# EAGLE board 16_Bit_Register (EAGLE 9.6.2)
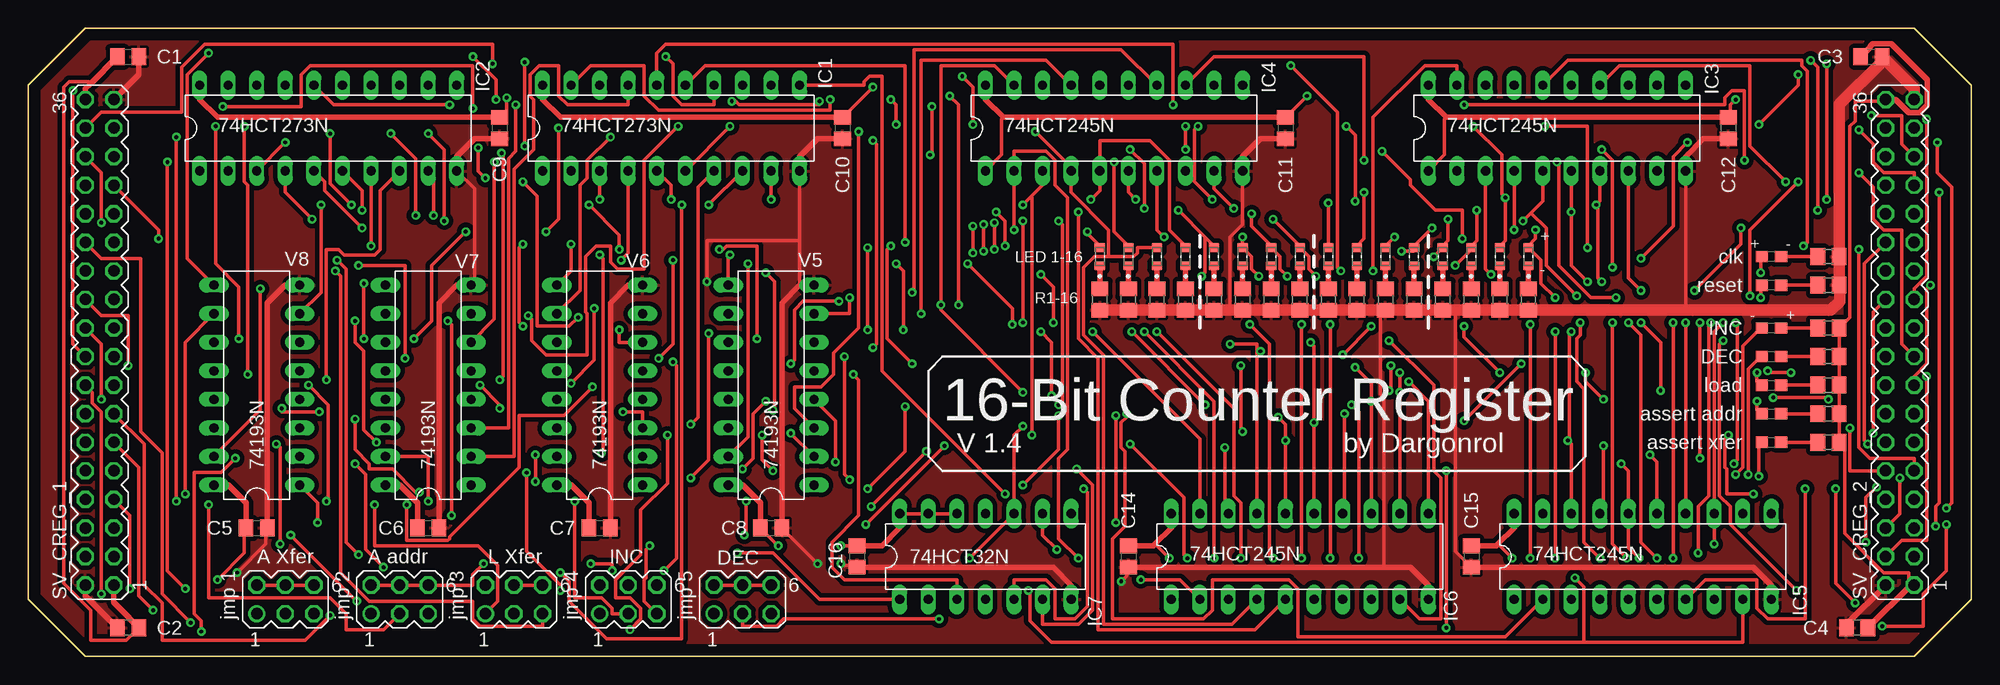
[diagram p1: board, top side]
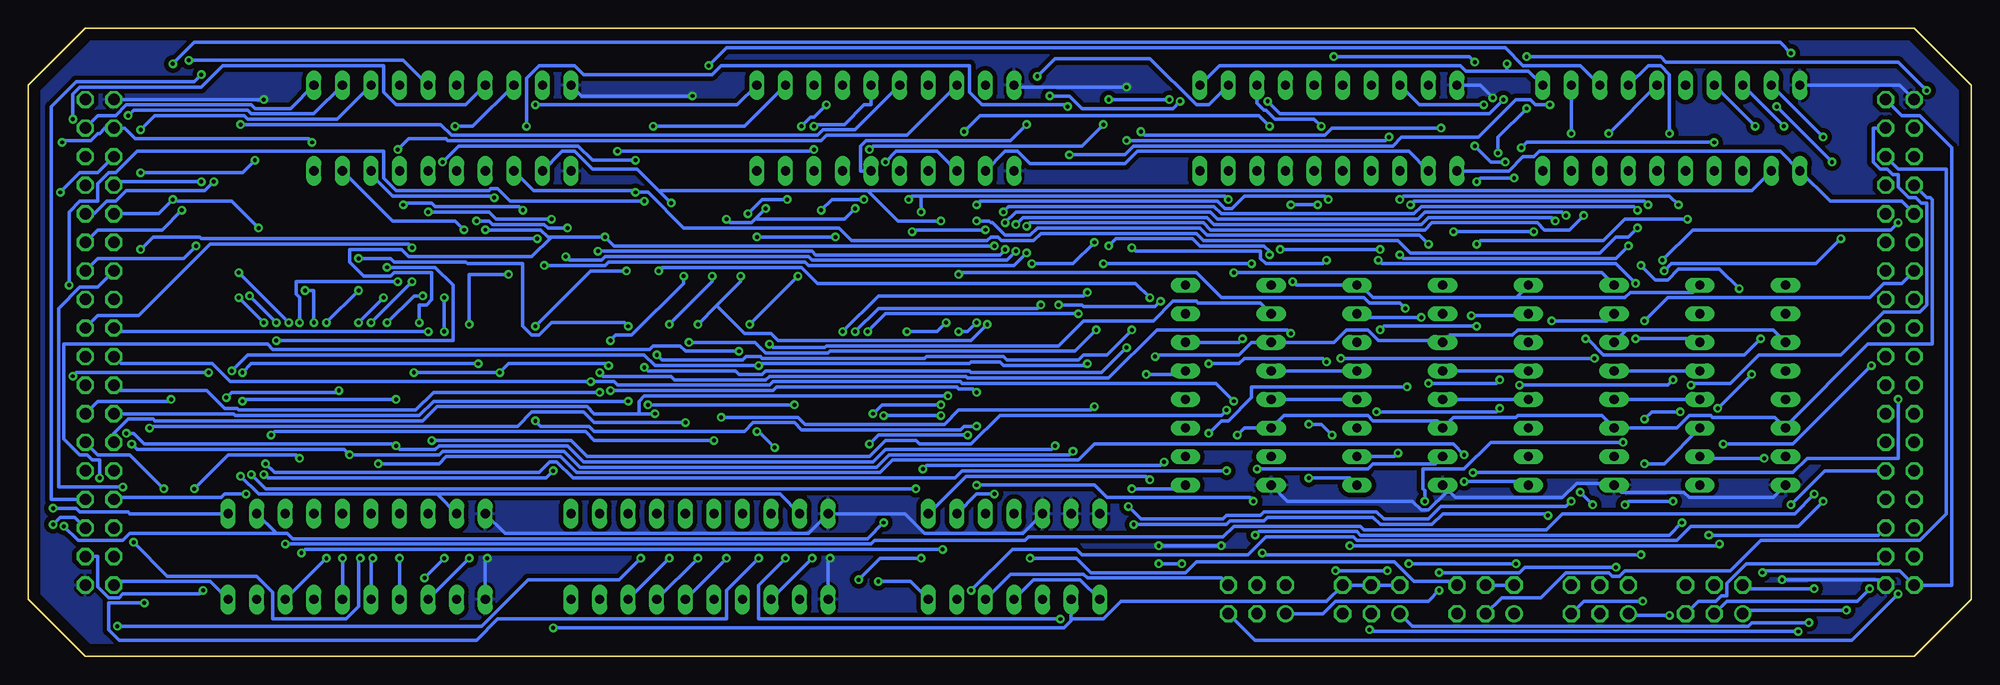
[diagram p2: board, bottom side, seen from below]

Size 172.72 x 55.88 mm. Coordinates in mm from the lower left corner, seen from the top.
Outline: 0,50.8 0,5.08 5.08,0 167.64,0 172.72,5.08 172.72,50.8 167.64,55.88 5.08,55.88 0,50.8
Copper layers (1*16): Top 0.035mm / dielectric 1.5mm / Bottom 0.035mm
Design rules "default *": minimum track width 12mil, minimum drill 0.35mm, track to track 6mil, track to pad 6mil, pad to pad 6mil, via to via 6mil, smd to smd 6mil, copper to edge 40mil, drill to drill 6mil, minimum pad ring 10mil, minimum via ring 8mil, stop-mask expansion 4mil, vias tented up to drill 0mil, thermal gap 10mil

## Footprints (pad centres in the part's own frame; a part is rotated, then mirrored left to right if it is on the bottom)
0603 = smd 1.1 x 1: 1 -0.85,0; 2 0.85,0
C0805 = smd 1.3 x 1.5: 1 -0.95,0; 2 0.95,0
DIL20 = drill 0.813 long: 1 -11.43,-3.81; 2 -8.89,-3.81; 3 -6.35,-3.81; 4 -3.81,-3.81; 5 -1.27,-3.81; 6 1.27,-3.81; 7 3.81,-3.81; 8 6.35,-3.81; 9 8.89,-3.81; 10 11.43,-3.81; 11 11.43,3.81; 12 8.89,3.81; 13 6.35,3.81; 14 3.81,3.81; 15 1.27,3.81; 16 -1.27,3.81; 17 -3.81,3.81; 18 -6.35,3.81; 19 -8.89,3.81; 20 -11.43,3.81
DIL14 = drill 0.813 long: 1 -7.62,-3.81; 2 -5.08,-3.81; 3 -2.54,-3.81; 4 0,-3.81; 5 2.54,-3.81; 6 5.08,-3.81; 7 7.62,-3.81; 8 7.62,3.81; 9 5.08,3.81; 10 2.54,3.81; 11 0,3.81; 12 -2.54,3.81; 13 -5.08,3.81; 14 -7.62,3.81
LEDC1608X45N = smd 0.81 x 0.93: A 0.81,0; C -0.81,0
R0805 = smd 1.3 x 1.5: 1 -0.95,0; 2 0.95,0
MA03-2 = drill 1.016: 1 -2.54,-1.27 | drill 1.016 octagon: 2 -2.54,1.27; 3 0,-1.27; 4 0,1.27; 5 2.54,-1.27; 6 2.54,1.27
MA18-2 = drill 1.016 octagon: 1 -21.59,-1.27; 2 -21.59,1.27; 3 -19.05,-1.27; 4 -19.05,1.27; 5 -16.51,-1.27; 6 -16.51,1.27; 7 -13.97,-1.27; 8 -13.97,1.27; 9 -11.43,-1.27; 10 -11.43,1.27; 11 -8.89,-1.27; 12 -8.89,1.27; 13 -6.35,-1.27; 14 -6.35,1.27; 15 -3.81,-1.27; 16 -3.81,1.27; 17 -1.27,-1.27; 18 -1.27,1.27; 19 1.27,-1.27; 20 1.27,1.27; 21 3.81,-1.27; 22 3.81,1.27; 23 6.35,-1.27; 24 6.35,1.27; 25 8.89,-1.27; 26 8.89,1.27; 27 11.43,-1.27; 28 11.43,1.27; 29 13.97,-1.27; 30 13.97,1.27; 31 16.51,-1.27; 32 16.51,1.27; 33 19.05,-1.27; 34 19.05,1.27; 35 21.59,-1.27; 36 21.59,1.27
DIL16 = drill 0.813 long: 1 -8.89,-3.81; 2 -6.35,-3.81; 3 -3.81,-3.81; 4 -1.27,-3.81; 5 1.27,-3.81; 6 3.81,-3.81; 7 6.35,-3.81; 8 8.89,-3.81; 9 8.89,3.81; 10 6.35,3.81; 11 3.81,3.81; 12 1.27,3.81; 13 -1.27,3.81; 14 -3.81,3.81; 15 -6.35,3.81; 16 -8.89,3.81

## Placement (x,y rotation side)
ASSERT_ADDR  LTST-C193TBKT-5A  [0603]  154.94,21.59 0 top
ASSERT_XFER  LTST-C193TBKT-5A  [0603]  154.94,19.05 0 top
C1  1µF  [C0805]  8.89,53.34 0 top
C2  1µF  [C0805]  8.89,2.54 180 top
C3  1µF  [C0805]  163.83,53.34 0 top
C4  1µF  [C0805]  162.56,2.54 180 top
C5  100pF  [C0805]  20.32,11.43 0 top
C6  100pF  [C0805]  35.56,11.43 0 top
C7  100pF  [C0805]  50.8,11.43 0 top
C8  100pF  [C0805]  66.04,11.43 0 top
C9  100pF  [C0805]  41.91,46.99 270 top
C10  100pF  [C0805]  72.39,46.99 270 top
C11  100pF  [C0805]  111.76,46.99 270 top
C12  100pF  [C0805]  151.13,46.99 270 top
C14  100pF  [C0805]  97.79,8.89 270 top
C15  100pF  [C0805]  128.27,8.89 270 top
C16  100pF  [C0805]  73.66,8.89 270 top
CLK  LTST-C193TBKT-5A  [0603]  154.94,35.56 180 top
DEC  LTST-C193TBKT-5A  [0603]  154.94,26.67 0 top
IC1  74HCT273N  [DIL20]  57.15,46.99 0 top
IC2  74HCT273N  [DIL20]  26.67,46.99 0 top
IC3  74HCT245N  [DIL20]  135.89,46.99 0 top
IC4  74HCT245N  [DIL20]  96.52,46.99 0 top
IC5  74HCT245N  [DIL20]  143.51,8.89 0 top
IC6  74HCT245N  [DIL20]  113.03,8.89 0 top
IC7  74HCT32N  [DIL14]  85.09,8.89 0 top
INC  LTST-C193TBKT-5A  [0603]  154.94,29.21 0 top
LED_1  LTST-C193KRKT-5A  [LEDC1608X45N]  133.35,35.56 90 top
LED_2  LTST-C193KRKT-5A  [LEDC1608X45N]  130.81,35.56 90 top
LED_3  LTST-C193KRKT-5A  [LEDC1608X45N]  128.27,35.56 90 top
LED_4  LTST-C193KRKT-5A  [LEDC1608X45N]  125.73,35.56 90 top
LED_5  LTST-C193KRKT-5A  [LEDC1608X45N]  123.19,35.56 90 top
LED_6  LTST-C193KRKT-5A  [LEDC1608X45N]  120.65,35.56 90 top
LED_7  LTST-C193KRKT-5A  [LEDC1608X45N]  118.11,35.56 90 top
LED_8  LTST-C193KRKT-5A  [LEDC1608X45N]  115.57,35.56 90 top
LED_9  LTST-C193KRKT-5A  [LEDC1608X45N]  113.03,35.56 90 top
LED_10  LTST-C193KRKT-5A  [LEDC1608X45N]  110.49,35.56 90 top
LED_11  LTST-C193KRKT-5A  [LEDC1608X45N]  107.95,35.56 90 top
LED_12  LTST-C193KRKT-5A  [LEDC1608X45N]  105.41,35.56 90 top
LED_13  LTST-C193KRKT-5A  [LEDC1608X45N]  102.87,35.56 90 top
LED_14  LTST-C193KRKT-5A  [LEDC1608X45N]  100.33,35.56 90 top
LED_15  LTST-C193KRKT-5A  [LEDC1608X45N]  97.79,35.56 90 top
LED_16  LTST-C193KRKT-5A  [LEDC1608X45N]  95.25,35.56 90 top
LOAD  LTST-C193TBKT-5A  [0603]  154.94,24.13 0 top
R1  1600  [R0805]  133.35,31.75 90 top
R2  1600  [R0805]  130.81,31.75 90 top
R3  1600  [R0805]  128.27,31.75 90 top
R4  1600  [R0805]  125.73,31.75 90 top
R5  1600  [R0805]  123.19,31.75 90 top
R6  1600  [R0805]  120.65,31.75 90 top
R7  1600  [R0805]  118.11,31.75 90 top
R8  1600  [R0805]  115.57,31.75 90 top
R9  1600  [R0805]  113.03,31.75 90 top
R10  1600  [R0805]  110.49,31.75 90 top
R11  1600  [R0805]  107.95,31.75 90 top
R12  1600  [R0805]  105.41,31.75 90 top
R13  1600  [R0805]  102.87,31.75 90 top
R14  1600  [R0805]  100.33,31.75 90 top
R15  1600  [R0805]  97.79,31.75 90 top
R16  1600  [R0805]  95.25,31.75 90 top
R17  560  [R0805]  160.02,35.56 180 top
R18  560  [R0805]  160.02,33.02 180 top
R19  560  [R0805]  160.02,19.05 0 top
R20  560  [R0805]  160.02,21.59 0 top
R21  560  [R0805]  160.02,24.13 0 top
R22  560  [R0805]  160.02,29.21 0 top
R23  560  [R0805]  160.02,26.67 0 top
RESET  LTST-C193TBKT-5A  [0603]  154.94,33.02 180 top
SV3  [MA03-2]  22.86,5.08 0 top
SV4  [MA03-2]  33.02,5.08 0 top
SV5  [MA03-2]  43.18,5.08 0 top
SV6  [MA03-2]  53.34,5.08 0 top
SV7  [MA03-2]  63.5,5.08 0 top
SV_CREG_1  [MA18-2]  6.35,27.94 90 top
SV_CREG_2  [MA18-2]  166.37,27.94 90 top
V5  74193N  [DIL16]  66.04,24.13 90 top
V6  74193N  [DIL16]  50.8,24.13 90 top
V7  74193N  [DIL16]  35.56,24.13 90 top
V8  74193N  [DIL16]  20.32,24.13 90 top

## Tracks (layer width: path | path; a pad name or v marks a point on that pad's centre or on a via)
!BUS_CTRL_CREG_ASSERT_ADDR  (via drill 0.35)
  Top 0.305: v26.83,3.65 24.61,1.43 11.91,1.43 11.91,4.76 10.32,6.35 10.32,18.89 SV_CREG_1.13
  Bottom 0.305: SV4.1 30.32,3.65 v26.83,3.65
!BUS_CTRL_CREG_ASSERT_XFER  (via drill 0.35)
  Top 0.305: v11.11,4.13 9.84,5.4 9.84,16.83 SV_CREG_1.11
  Bottom 0.305: SV3.1 20,4.13 v11.11,4.13
!BUS_CTRL_CREG_DEC  (via drill 0.35)
  Top 0.305: SV_CREG_1.20 6.51,27.78 v6.51,22.86 | v44.29,16.35 44.29,9.37 47.31,6.35 v47.31,5.87
  Bottom 0.305: v6.51,22.86 6.51,17.62 14.61,17.62 15.88,16.35 v44.29,16.35 | v47.31,5.87 48.26,4.92 56.52,4.92 57.63,3.81 SV7.1
!BUS_CTRL_CREG_INC  (via drill 0.35)
  Top 0.305: SV_CREG_1.26 6.51,35.4 10,35.4 10,20 11.91,18.1 11.91,5.56 v14.45,3.02
  Bottom 0.305: v14.45,3.02 19.53,3.02 19.84,2.7 49.69,2.7 SV6.1
!BUS_CTRL_CREG_LOAD_XFER  (via drill 0.35)
  Top 0.305: SV5.1 41.75,4.92 41.75,8.1 40.01,9.84 30.8,9.84 v30.8,13.49 | v26.51,13.81 26.67,13.97 26.67,22.38 v24.92,24.13
  Bottom 0.305: v30.8,13.49 30.48,13.81 v26.51,13.81 | v24.92,24.13 24.77,24.29 21.43,24.29 18.89,26.83 11.59,26.83 7.78,30.64 4.6,30.64 3.97,31.27 3.97,40.32 4.45,40.32 4.92,40.8 5.56,40.8 6.51,41.75 6.51,42.86 6.99,42.86 7.46,43.34 8.1,43.34 8.73,43.97 8.73,46.99 SV_CREG_1.33
!BUS_CTRL_PC_ASSERT_ADDR  (via drill 0.35)
  Top 0.305: v29.21,4.92 v23.34,10.79
  Bottom 0.305: SV_CREG_1.5 8.26,10.79 v23.34,10.79 | v29.21,4.92 34.45,4.92 SV4.5
!BUS_CTRL_PC_ASSERT_XFER
  Bottom 0.305: SV_CREG_1.3 8.26,8.26 20,8.26 21.75,6.51 21.75,5.4 22.23,5.4 22.7,4.92 24.29,4.92 SV3.5
!BUS_CTRL_PC_DEC  (via drill 0.35)
  Top 0.305: SV_CREG_1.16 5.71,23.5 5.71,22.54 6.51,21.75 v6.51,5.56
  Bottom 0.305: v6.51,5.56 10.64,1.43 63.66,1.43 SV7.5
!BUS_CTRL_PC_INC  (via drill 0.35)
  Top 0.305: SV_CREG_1.22 6.51,30.32 8.89,30.32 v8.89,25.88 | v22.07,18.89 22.38,18.57 v22.38,10 | v55.24,9.84 54.93,9.53 54.93,6.99 54.77,6.83 54.77,4.92 SV6.5
  Bottom 0.305: v8.89,25.88 15.88,18.89 v22.07,18.89 | v22.38,10 22.54,9.84 v55.24,9.84
!BUS_CTRL_PC_LOAD_XFER  (via drill 0.35)
  Top 0.305: SV_CREG_1.29 11.59,37.94 v11.59,37.15 | v27.3,34.29 27.78,33.81 27.78,7.46 30.32,4.92 39.53,4.92 39.53,3.33 40.16,2.7 45.72,2.7 SV5.5
  Bottom 0.305: v11.59,37.15 13.81,34.92 26.67,34.92 v27.3,34.29
!BUS_CTRL_SP_ASSERT_ADDR  (via drill 0.35)
  Top 0.305: SV4.3 31.59,2.38 28.26,2.38 28.26,3.81 26.83,5.24 16.03,5.24 v16.03,13.49
  Bottom 0.305: v16.03,13.49 13.02,16.51 SV_CREG_1.9
!BUS_CTRL_SP_ASSERT_XFER  (via drill 0.35)
  Top 0.305: SV_CREG_1.7 9.05,12.54 v9.05,6.03
  Bottom 0.305: v9.05,6.03 10.16,4.92 21.75,4.92 SV3.3
!BUS_CTRL_SP_DEC  (via drill 0.35)
  Top 0.305: SV_CREG_1.18 3.97,27.78 v3.97,50.32 | v39.53,53.34 41.59,51.28 v41.59,49.53 | v62.55,49.37 62.87,49.37 63.18,49.05 70.33,49.05 v70.33,49.37 | v81.92,49.85 82.71,49.05 v82.71,31.27 | v99.22,28.89 105.41,22.7 v105.41,8.73 | v80.96,3.33 67.15,3.33 66.52,2.7 63.5,2.7 SV7.3
  Bottom 0.305: v3.97,50.32 6.51,52.86 27.15,52.86 27.62,53.34 v39.53,53.34 | v41.59,49.53 42.86,48.26 61.44,48.26 v62.55,49.37 | v70.33,49.37 70.96,48.74 79.06,48.74 80.17,49.85 v81.92,49.85 | v82.71,31.27 83.03,30.96 97.16,30.96 v99.22,28.89 | v105.41,8.73 107.79,6.35 107.79,3.33 v80.96,3.33
!BUS_CTRL_SP_INC  (via drill 0.35)
  Top 0.305: SV6.3 51.91,3.81 51.91,4.29 50.96,5.24 48.58,5.24 v48.58,13.81 | v30.96,19.05 29.84,20.16 29.84,27.15 29.05,27.94 v29.05,29.84
  Bottom 0.305: v48.58,13.81 48.58,14.76 48.74,14.92 48.74,16.67 45.09,16.67 42.7,19.05 v30.96,19.05 | v29.05,29.84 26.99,31.91 9.05,31.91 7.78,33.18 6.19,33.18 SV_CREG_1.24
!BUS_CTRL_SP_LOAD_XFER
  Bottom 0.305: SV5.3 41.75,5.24 38.26,5.24 36.04,7.46 32.23,7.46 31.91,7.14 31.27,7.14 30.8,7.62 21.43,7.62 18.73,10.32 4.6,10.32 2.22,12.7 2.22,43.34 6.51,43.34 SV_CREG_1.31
!CTRL_CREG_ASSERT_ADDR  (via drill 0.35)
  Top 0.305: SV4.2 SV4.4 SV4.6 39.53,6.35 39.53,7.3 v40.48,8.26 | v153.67,22.7 153.67,21.91 153.99,21.59 ASSERT_ADDR.1 | v140.02,22.86 138.43,24.45 v138.43,25.24 | v130.81,25.24 127.64,28.42 v127.64,29.37 | v119.54,34.29 119.54,47.94 124.14,52.55 127,52.55 IC3.19 | IC4.19 85.88,52.55 81.12,52.55 v81.12,31.27 81.12,30.8 v88.42,23.5 | v120.97,23.65 121.13,23.81 v121.13,25.88 | v50.01,8.26 51.91,8.26 v51.91,7.62 | v56.52,7.62 57.63,8.73 57.63,25.88 v57.31,26.19 | v67.79,26.04 68.1,26.35 68.1,30.8 68.9,31.59 v72.07,31.59
  Bottom 0.305: v153.67,22.7 153.51,22.86 v140.02,22.86 | v138.43,25.24 v130.81,25.24 130.02,26.04 121.28,26.04 v121.13,25.88 | v127.64,29.37 122.71,34.29 v119.54,34.29 | v88.42,23.5 88.74,23.81 90.01,23.81 90.17,23.97 106.2,23.97 106.52,23.65 v120.97,23.65 | v50.01,8.26 v40.48,8.26 | v56.52,7.62 v51.91,7.62 | v57.31,26.19 57.63,26.51 64.61,26.51 65.09,26.04 v67.79,26.04 | v72.07,31.59 72.55,31.11 78.9,31.11 79.06,31.27 v81.12,31.27
!CTRL_CREG_ASSERT_XFER  (via drill 0.35)
  Top 0.305: SV3.2 SV3.4 SV3.6 | v153.83,16.03 153.83,18.89 153.99,19.05 ASSERT_XFER.1 | v13.97,6.03 12.38,7.62 v12.38,43.97 | v17.3,48.9 24.29,48.9 24.29,51.75 25.08,52.55 39.53,52.55 v39.53,48.74 | v42.07,44.77 42.23,44.61 42.23,24.92 v41.91,24.61 | v48.26,24.29 50.32,26.35 v50.32,30.96 | v90.01,33.97 91.12,32.86 v91.12,29.69 | v94.61,28.89 104.14,19.37 IC6.19
  Bottom 0.305: v153.83,16.03 152.24,14.45 136.37,14.45 136.29,14.37 | IC5.19 136.29,14.37 | IC6.19 105.89,14.45 136.21,14.45 136.29,14.37 | SV3.2 20,6.03 v13.97,6.03 | v17.3,48.9 v12.38,43.97 | v39.53,48.74 42.07,46.2 v42.07,44.77 | v41.91,24.61 42.23,24.29 v48.26,24.29 | v50.32,30.96 50.8,31.43 53.5,31.43 53.98,31.91 66.67,31.91 68.9,34.13 89.85,34.13 v90.01,33.97 | v91.12,29.69 91.92,28.89 v94.61,28.89
!CTRL_CREG_DEC  (via drill 0.35)
  Top 0.305: SV7.2 SV7.4 SV7.6 | v152.88,16.19 152.88,25.56 153.99,26.67 DEC.1 | v93.82,14.92 94.14,14.61 94.14,4.45 93.03,3.33 91.28,3.33 91.28,6.03 90.49,6.83 87.63,6.83 IC7.5
  Bottom 0.305: v152.88,16.19 151.61,14.92 v93.82,14.92 | SV7.6 66.67,6.99 78.58,6.99 78.9,7.3 85.41,7.3 IC7.5
!CTRL_CREG_INC  (via drill 0.35)
  Top 0.305: v151.76,16.19 152.4,16.83 152.4,27.62 153.99,29.21 INC.1 | v126.05,2.54 v126.05,16.51
  Bottom 0.305: SV6.2 SV6.4 SV6.6 57.31,4.92 75.56,4.92 77.15,3.33 80.01,3.33 | v151.76,16.19 151.45,15.88 126.68,15.88 v126.05,16.51 | v126.05,2.54 80.64,2.54 80.01,3.17 80.01,3.33 | IC7.2 80.01,3.33
!CTRL_CREG_LOAD_XFER  (via drill 0.35)
  Top 0.305: SV5.4 SV5.6 | v153.67,25.24 153.67,24.45 153.99,24.13 LOAD.1 | v127.64,20.95 v132.72,26.04 | v88.42,20.48 87.63,19.68 IC7.10 v83.66,8.73
  Bottom 0.305: SV5.4 SV5.2 | v153.67,25.24 152.88,26.04 v132.72,26.04 | v127.64,20.95 127.16,20.48 122.87,20.48 122.4,20 109.06,20 108.27,20.8 104.62,20.8 103.98,20.16 89.85,20.16 89.53,20.48 v88.42,20.48 | SV5.6 46.04,6.67 49.53,6.67 51.28,8.41 68.9,8.41 69.85,7.46 78.26,7.46 79.53,8.73 v83.66,8.73
BUS_!CLK  (via drill 0.35)
  Top 0.305: SV_CREG_1.32 6.51,43.02 v6.51,38.58 | v27.46,35.24 28.26,34.45 28.26,10.16 v29.37,9.05 | v63.02,9.21 66.2,9.21 70.33,5.08 IC7.1
  Bottom 0.305: IC7.1 79.22,6.83 83.34,6.83 IC7.4 | v6.51,38.58 7.14,37.94 24.77,37.94 v27.46,35.24 | v29.37,9.05 62.87,9.05 v63.02,9.21
BUS_!RESET
  Bottom 0.305: SV_CREG_1.28 6.19,40.48 12.54,40.48 IC2.1 16.99,44.93 38.42,44.93 38.89,44.45 39.85,44.45 41.12,43.18 IC1.1
BUS_ADDRESS_BUS_0
  Bottom 0.305: IC3.11 149.38,48.74 152.56,48.74 152.88,49.05 163.99,49.05 164.94,48.1 166.53,48.1 SV_CREG_2.33
BUS_ADDRESS_BUS_1  (via drill 0.35)
  Top 0.305: v163.83,48.1 166.53,48.1 166.53,45.56 SV_CREG_2.31
  Bottom 0.305: IC3.12 147.32,48.26 152.88,48.26 153.19,48.58 163.35,48.58 v163.83,48.1
BUS_ADDRESS_BUS_2  (via drill 0.35)
  Top 0.305: v162.72,46.83 163.99,45.56 163.99,43.97 164.94,43.02 167.64,43.02 SV_CREG_2.29
  Bottom 0.305: IC3.13 145.26,47.78 153.19,47.78 153.51,48.1 161.45,48.1 v162.72,46.83
BUS_ADDRESS_BUS_3  (via drill 0.35)
  Top 0.305: IC3.14 141.45,52.55 153.03,52.55 153.03,45.4 v156.21,42.23
  Bottom 0.305: v156.21,42.23 157,41.43 163.99,41.43 164.94,40.48 165.74,40.48 166.85,39.37 SV_CREG_2.27
BUS_ADDRESS_BUS_4  (via drill 0.35)
  Top 0.305: v158.43,53.02 159.07,52.39 v159.07,39.69
  Bottom 0.305: IC3.15 139.38,53.02 v158.43,53.02 | v159.07,39.69 160.81,37.94 166.53,37.94 SV_CREG_2.25
BUS_ADDRESS_BUS_5  (via drill 0.35)
  Top 0.305: IC3.16 136.84,53.02 157.64,53.02 157.64,52.55 158.12,52.07 158.12,36.83 v157.8,36.51
  Bottom 0.305: v157.8,36.51 158.91,35.4 166.53,35.4 SV_CREG_2.23
BUS_ADDRESS_BUS_6  (via drill 0.35)
  Top 0.305: v168.75,47.78 168.75,33.81 167.64,32.7 SV_CREG_2.21
  Bottom 0.305: IC3.17 133.83,49.05 140.02,49.05 141.13,50.16 141.13,52.55 155.42,52.55 157.32,50.64 168.12,50.64 168.75,50.01 v168.75,47.78
BUS_ADDRESS_BUS_7  (via drill 0.35)
  Top 0.305: v134.78,47.15 138.59,47.15 v138.59,36.35
  Bottom 0.305: IC3.18 133.19,47.15 v134.78,47.15 | v138.59,36.35 138.91,36.67 156.53,36.67 162.88,30.32 166.53,30.32 SV_CREG_2.19
BUS_ADDRESS_BUS_8  (via drill 0.35)
  Top 0.305: v127.64,49.05 150.81,49.05 150.81,49.69 151.45,50.32 152.56,50.32 v152.56,44.13 | v162.72,43.02 163.99,41.75 163.99,38.89 164.94,37.94 166.53,37.94 166.53,27.78 SV_CREG_2.17
  Bottom 0.305: IC4.11 109.7,49.05 v127.64,49.05 | v152.56,44.13 153.67,43.02 v162.72,43.02
BUS_ADDRESS_BUS_9  (via drill 0.35)
  Top 0.305: v117.16,47.15 117.95,46.35 v117.95,40.48 | v169.07,33.02 168.75,32.7 168.75,26.04 167.64,24.92 SV_CREG_2.15
  Bottom 0.305: IC4.12 109.06,47.15 v117.16,47.15 | v117.95,40.48 129.86,40.48 130.97,41.59 131.6,41.59 131.76,41.43 140.02,41.43 141.13,42.55 141.13,44.93 163.04,44.93 164.94,43.02 165.58,43.02 166.53,42.07 166.53,40.48 168.12,40.48 169.07,39.53 v169.07,33.02
BUS_ADDRESS_BUS_10  (via drill 0.35)
  Top 0.305: IC4.13 105.41,53.34 118.75,53.34 v118.75,44.13 | v135.89,43.97 136.05,43.81 136.05,34.77 138.91,31.91 v141.13,31.91 | v143.35,29.69 145.1,27.94 v145.1,23.65 | v155.1,23.02 160.02,23.02 v160.02,22.86
  Bottom 0.305: v118.75,44.13 122.56,44.13 123.83,45.4 134.46,45.4 v135.89,43.97 | v143.35,29.69 v141.13,31.91 | v145.1,23.65 145.26,23.5 154.62,23.5 v155.1,23.02 | v160.02,22.86 160.18,22.7 166.53,22.7 SV_CREG_2.13
BUS_ADDRESS_BUS_11  (via drill 0.35)
  Top 0.305: IC4.14 97.16,53.98 78.74,53.98 78.74,32.54 v78.58,32.38 | v100.33,28.89 107.16,22.07 107.16,14.29 107.79,13.65 v107.79,8.73 | v162.4,4.76 160.66,6.51 v160.66,14.92
  Bottom 0.305: v78.58,32.38 78.9,32.07 97.16,32.07 v100.33,28.89 | v107.79,8.73 110.65,5.87 110.65,3.33 130.97,3.33 132.87,1.43 164.62,1.43 165.58,2.38 165.58,4.76 v162.4,4.76 | v160.66,14.92 163.67,17.94 166.53,17.94 SV_CREG_2.11
BUS_ADDRESS_BUS_12  (via drill 0.35)
  Top 0.305: v102.87,45.09 v102.87,47.15 | v120.33,44.93 122.87,42.39 122.87,41.91 125.09,39.69 127.48,39.69 v127.48,37.15 | v162.72,36.2 162.72,18.57 163.67,17.62 167.64,17.62 SV_CREG_2.9
  Bottom 0.305: IC4.15 97.79,49.05 98.42,49.05 100.17,47.31 102.71,47.31 v102.87,47.15 | v102.87,45.09 103.03,44.93 v120.33,44.93 | v127.48,37.15 157.32,37.15 157.48,37.31 161.61,37.31 v162.72,36.2
BUS_ADDRESS_BUS_13  (via drill 0.35)
  Top 0.305: v153.83,47.31 157.32,50.8 v157.32,51.75
  Bottom 0.305: IC4.16 99.22,46.83 102.08,46.83 102.55,46.35 135.1,46.35 136.05,47.31 v153.83,47.31 | v157.32,51.75 157.96,51.12 168.43,51.12 170.66,48.9 170.66,13.97 SV_CREG_2.7
BUS_ADDRESS_BUS_14  (via drill 0.35)
  Top 0.305: IC4.17 90.49,53.02 79.38,53.02 v79.38,30.48 | v104.62,22.38 v98.11,28.89 | v117.63,22.38 118.27,21.75 v118.27,8.73 | v164.78,2.7 168.43,2.7 168.43,5.56 170.5,7.62 v170.5,11.75
  Bottom 0.305: v79.38,30.48 96.52,30.48 v98.11,28.89 | v117.63,22.38 v104.62,22.38 | v118.27,8.73 120.17,6.83 128.27,6.83 132.4,2.7 v164.78,2.7 | v170.5,11.75 169.86,12.38 168.59,12.38 SV_CREG_2.5
BUS_ADDRESS_BUS_15  (via drill 0.35)
  Top 0.305: v139.86,45.09 140.81,44.13 v140.81,34.61 | v150.65,28.1 150.34,27.78 150.34,14.29 151.29,13.34 151.29,11.75 v157.16,5.87
  Bottom 0.305: IC4.18 94.61,46.35 101.76,46.35 102.23,45.88 135.41,45.88 135.57,46.04 138.91,46.04 v139.86,45.09 | v140.81,34.61 136.53,34.61 134.94,33.02 134.94,28.1 v150.65,28.1 | v157.16,5.87 157.48,5.56 164.31,5.56 164.62,5.24 165.58,5.24 166.53,6.19 166.53,8.89 SV_CREG_2.3
BUS_CLK  (via drill 0.35)
  Top 0.305: SV_CREG_1.34 6.51,48.42 13.65,48.42 13.65,52.39 15.72,54.45 41.27,54.45 v41.27,52.7 | v153.99,34.13 153.99,35.56 CLK.2 | v149.54,29.69 149.38,29.53 149.38,14.29 148.43,13.34 v148.43,9.21 | v91.44,9.53 90.17,10.79 IC7.9 | IC1.11 74.3,50.8 74.3,51.12 74.77,51.59 75.88,51.59 75.88,25.4 v86.84,14.45
  Bottom 0.305: IC2.11 39.37,52.07 41.27,52.07 | 41.27,52.07 44.93,52.07 45.4,52.55 66.83,52.55 IC1.11 | 41.27,52.07 v41.27,52.7 | v149.54,29.69 v153.99,34.13 | v148.43,9.21 148.11,9.53 v91.44,9.53 | v86.84,14.45 88.42,14.45 IC7.9
BUS_RESET  (via drill 0.35)
  Top 0.305: v153.99,31.91 153.99,33.02 RESET.2 | v151.76,29.69 151.92,29.53 151.92,17.46 v151.61,17.14 | v66.2,16.51 65.25,17.46 v65.25,19.68
  Bottom 0.305: SV_CREG_1.30 3.97,40.8 3.65,40.8 3.49,40.64 3.49,27.78 9.21,27.78 16.51,20.48 V8.14 17.46,21.27 23.02,21.27 23.18,21.43 25.08,21.43 26.19,20.32 V7.14 32.86,21.43 40.32,21.43 40.48,21.27 46.04,21.27 V6.14 46.99,20.48 47.47,20.95 53.18,20.95 53.66,21.43 61.12,21.43 V5.14 64.61,20.32 v65.25,19.68 | v151.76,29.69 v153.99,31.91 | v151.61,17.14 150.81,16.35 127.32,16.35 126.36,17.3 125.73,17.3 124.3,15.88 90.33,15.88 89.69,16.51 v66.2,16.51
BUS_XFER_BUS_0  (via drill 0.35)
  Top 0.305: V8.15 20.64,21.91 v20.64,32.7 | v29.37,34.77 33.5,34.77 v33.5,26.51 | v56.04,26.51 57.31,27.78 v57.31,35.24 | v74.61,29.05 v74.61,36.35 | v119.38,29.37 v116.84,26.83 | v143.35,35.4 146.21,38.26 146.21,44.45 v147.48,45.72 | v170.5,13.18 170.97,13.65 170.97,41.75 169.7,43.02 v169.7,45.72
  Bottom 0.305: v20.64,32.7 22.38,34.45 26.04,34.45 26.99,33.5 28.1,33.5 v29.37,34.77 | v56.04,26.51 v33.5,26.51 | v57.31,35.24 57.63,34.92 62.71,34.92 63.18,35.4 63.18,36.04 74.3,36.04 v74.61,36.35 | v74.61,29.05 76.83,26.83 78.9,26.83 79.38,26.35 85.72,26.35 86.04,26.67 92.87,26.67 93.03,26.51 107.47,26.51 107.63,26.67 108.9,26.67 109.22,26.35 116.36,26.35 v116.84,26.83 | v119.38,29.37 119.7,29.69 126.21,29.69 127.32,28.57 127.95,28.57 128.75,29.37 128.75,34.92 133.67,34.92 133.83,35.08 140.18,35.08 140.49,35.4 v143.35,35.4 | v147.48,45.72 147.8,46.04 163.19,46.04 164.15,46.99 SV_CREG_2.34 165.89,46.99 166.37,46.51 166.53,46.51 167.16,45.88 169.54,45.88 v169.7,45.72 | IC5.11 163.67,12.7 163.83,12.86 168.12,12.86 168.43,13.18 v170.5,13.18
BUS_XFER_BUS_1  (via drill 0.35)
  Top 0.305: V8.1 25.72,13.65 v25.72,11.91 | v63.66,10.79 63.82,10.95 v63.82,13.81 | v88.42,15.24 91.6,18.41 v91.6,21.43 | v96.68,11.91 v96.68,21.43 | v169.86,41.27 169.86,13.65 169.54,13.34 v169.54,11.59
  Bottom 0.305: v25.72,11.91 26.83,10.79 54.29,10.79 54.61,11.11 63.34,11.11 v63.66,10.79 | v63.82,13.81 64.14,14.13 76.83,14.13 77.95,15.24 v88.42,15.24 | v96.68,21.43 v91.6,21.43 | v96.68,11.91 98.11,10.48 149.22,10.48 149.7,10.95 150.65,10.95 150.73,11.03 | IC5.12 150.73,11.03 | SV_CREG_2.32 166.53,43.02 168.12,43.02 v169.86,41.27 | v169.54,11.59 168.28,10.32 164.31,10.32 163.67,10.95 150.81,10.95 150.73,11.03
BUS_XFER_BUS_2  (via drill 0.35)
  Top 0.305: V8.10 13.97,27.94 v13.97,14.45 | v149.86,10 IC5.13 149.86,28.89 v150.65,29.69 | v157.32,42.23 153.03,37.94 v153.03,32.07
  Bottom 0.305: v13.97,14.45 15.72,12.7 36.35,12.7 37.78,11.27 53.98,11.27 54.29,11.59 65.56,11.59 66.52,10.64 83.82,10.64 84.14,10.32 97.47,10.32 97.79,10 v149.86,10 | SV_CREG_2.30 164.78,42.23 v157.32,42.23 | v150.65,29.69 v153.03,32.07
BUS_XFER_BUS_3  (via drill 0.35)
  Top 0.305: V8.9 14.13,35.4 14.13,51.75 v16.03,53.66 | v159.86,40.64 v159.86,52.7 | v147.32,29.69 IC5.14 | v148.11,32.54 152.24,36.67 v152.24,38.1
  Bottom 0.305: v16.03,53.66 16.99,54.61 157.96,54.61 v159.86,52.7 | SV_CREG_2.28 161.13,39.37 v159.86,40.64 159.86,40.48 154.62,40.48 v152.24,38.1 | v147.32,29.69 147.32,32.54 v148.11,32.54
BUS_XFER_BUS_4  (via drill 0.35)
  Top 0.305: V7.15 35.56,17.78 v35.56,13.81 | v79.85,18.26 v74.93,13.34 | v144.15,17.94 144.78,17.3 IC5.15 | SV_CREG_2.26 163.19,34.92 163.19,19.21 v163.51,18.89
  Bottom 0.305: v35.56,13.81 36.04,13.34 47.15,13.34 48.26,12.22 52.23,12.22 52.86,12.86 62.87,12.86 63.18,12.54 66.2,12.54 66.52,12.22 73.82,12.22 v74.93,13.34 | v79.85,18.26 80.17,17.94 96.2,17.94 97.31,16.83 123.67,16.83 125.09,18.26 135.89,18.26 136.21,17.94 v144.15,17.94 144.62,18.41 163.04,18.41 v163.51,18.89
BUS_XFER_BUS_5  (via drill 0.35)
  Top 0.305: v45.09,17.94 v45.09,15.56 | v141.6,17.14 142.24,16.51 IC5.16 142.24,9.68 v143.19,8.73 | v164.31,15.08 163.35,14.13 v163.35,10.16
  Bottom 0.305: V7.1 39.69,15.56 v45.09,15.56 | v45.09,17.94 46.04,18.89 77.95,18.89 79.38,17.46 95.89,17.46 97,16.35 123.98,16.35 125.41,17.78 135.57,17.78 136.21,17.14 v141.6,17.14 | SV_CREG_2.24 166.53,32.86 168.12,32.86 170.02,30.96 170.02,15.08 v164.31,15.08 | v163.35,10.16 160.34,7.14 152.4,7.14 150.97,5.71 150.97,3.33 144.46,3.33 143.35,4.45 143.35,8.73 v143.19,8.73
BUS_XFER_BUS_6  (via drill 0.35)
  Top 0.305: IC5.17 140.02,13.02 v140.02,18.73 | v163.99,19.84 163.99,30.64 SV_CREG_2.22 | v37.31,29.84 37.62,29.53 v37.62,12.54 | v81.44,18.73 v74.45,11.75
  Bottom 0.305: v163.99,19.84 163.35,19.84 162.4,18.89 140.18,18.89 v140.02,18.73 139.7,18.41 136.53,18.41 136.21,18.73 124.78,18.73 123.35,17.3 97.63,17.3 96.52,18.41 81.76,18.41 v81.44,18.73 | V7.10 32.38,29.84 v37.31,29.84 | v37.62,12.54 37.78,12.7 46.99,12.7 47.94,11.75 52.55,11.75 53.18,12.38 62.55,12.38 62.87,12.06 65.88,12.06 66.2,11.75 v74.45,11.75
BUS_XFER_BUS_7  (via drill 0.35)
  Top 0.305: v65.56,34.13 66.36,33.34 66.36,22.07 v66.2,21.91 | IC5.18 137.16,18.89 v136.84,19.21 137,19.21 137,28.73 v137.16,28.89
  Bottom 0.305: V7.9 32.86,34.13 v65.56,34.13 | v66.2,21.91 66.67,21.43 86.36,21.43 88.9,18.89 93.5,18.89 93.82,19.21 96.52,19.21 97.95,17.78 123.03,17.78 124.46,19.21 v136.84,19.21 | SV_CREG_2.20 164.78,28.89 v137.16,28.89
BUS_XFER_BUS_8  (via drill 0.35)
  Top 0.305: v63.5,16.67 64.45,17.62 64.45,21.59 v65.56,22.7 | v122.71,24.45 124.46,22.7 IC6.11
  Bottom 0.305: V6.15 47.62,17.14 53.18,17.14 53.66,16.67 v63.5,16.67 | v65.56,22.7 67.15,24.29 89.69,24.29 89.85,24.45 106.52,24.45 106.84,24.13 120.33,24.13 120.65,24.45 v122.71,24.45 154.78,24.45 156.37,26.04 164.47,26.04 SV_CREG_2.18
BUS_XFER_BUS_9  (via drill 0.35)
  Top 0.305: v58.9,15.88 60.48,17.46 v60.48,28.73 | IC6.12 v121.92,23.5 v121.92,25.24
  Bottom 0.305: V6.1 55.24,15.88 v58.9,15.88 | v60.48,28.73 60.8,29.05 72.39,29.05 76.68,24.77 89.22,24.77 89.38,24.92 106.84,24.92 107.16,24.61 115.25,24.61 115.57,24.92 121.6,24.92 v121.92,25.24 | SV_CREG_2.16 164.62,23.65 156.84,23.65 155.26,22.07 154.15,22.07 153.99,21.91 138.27,21.91 136.68,23.5 v121.92,23.5
BUS_XFER_BUS_10  (via drill 0.35)
  Top 0.305: V6.10 49.05,32.54 49.05,41.91 49.69,42.55 49.69,44.13 v51.75,46.2 | v75.09,45.88 75.41,45.56 75.41,27.78 v75.09,27.46 | v117.95,25.72 119.38,24.29 v119.38,22.7 IC6.13
  Bottom 0.305: v51.75,46.2 52.07,45.88 v75.09,45.88 | v75.09,27.46 77.31,25.24 88.9,25.24 89.06,25.4 107.16,25.4 107.47,25.08 109.54,25.08 109.86,25.4 117.63,25.4 v117.95,25.72 | SV_CREG_2.14 154.46,21.59 154.31,21.43 137.95,21.43 136.68,22.7 v119.38,22.7
BUS_XFER_BUS_11  (via drill 0.35)
  Top 0.305: IC6.14 117,12.86 v117,21.59 | V6.9 48.26,34.29 v48.26,36.67 | v88.42,29.69 v88.42,38.73 | v90.01,28.89 90.96,27.94 v90.96,23.18
  Bottom 0.305: 118.43,21.59 122.4,21.59 123.03,22.23 136.37,22.23 137.64,20.95 161.45,20.95 161.61,21.11 163.83,21.11 165.1,19.84 SV_CREG_2.12 | 118.43,21.59 v117,21.59 | v48.26,36.67 49.05,37.47 67.94,37.47 68.58,38.1 83.03,38.1 83.66,37.47 85.88,37.47 87,38.58 87.15,38.58 87.31,38.73 v88.42,38.73 | v88.42,29.69 89.22,28.89 v90.01,28.89 | v90.96,23.18 117.95,23.18 118.43,22.7 118.43,21.59
BUS_XFER_BUS_12  (via drill 0.35)
  Top 0.305: V5.15 63.98,19.53 v63.98,34.92 | v77.15,34.92 77.79,34.29 v77.79,29.05 | v113.98,27.94 114.3,27.62 v114.3,20.8 IC6.15 | SV_CREG_2.10 161.93,16.51 v161.93,20.32
  Bottom 0.305: v77.15,34.92 v63.98,34.92 | v77.79,29.05 79.69,27.15 101.44,27.15 101.6,26.99 107.16,26.99 108.11,27.94 v113.98,27.94 | v161.93,20.32 161.77,20.48 129.22,20.48 127.95,21.75 123.35,21.75 122.4,20.8 v114.3,20.8
BUS_XFER_BUS_13  (via drill 0.35)
  Top 0.305: v74.61,14.92 77.95,18.26 v77.95,22.23 | v111.12,21.27 111.76,20.64 v111.76,19.21 IC6.16 | v153.35,14.45 150.97,14.45 150.97,16.67 150.81,16.83 150.81,19.37 v151.13,19.68
  Bottom 0.305: V5.1 70.17,14.92 v74.61,14.92 | v77.95,22.23 78.26,21.91 90.01,21.91 91.28,20.64 103.66,20.64 104.3,21.27 v111.12,21.27 | SV_CREG_2.8 164.94,14.13 155.57,14.13 155.26,14.45 v153.35,14.45 | v151.13,19.68 150.81,20 123.19,20 122.4,19.21 v111.76,19.21
BUS_XFER_BUS_14  (via drill 0.35)
  Top 0.305: v106.84,27.78 109.22,27.78 109.22,27.15 | IC6.17 109.22,27.15 | SV_CREG_2.6 166.37,12.7 v166.37,15.88 | 109.22,27.15 v109.54,27.15
  Bottom 0.305: V5.10 63.18,31.43 68.74,31.43 68.9,31.59 70.96,31.59 72.71,29.84 78.9,29.84 81.12,27.62 101.76,27.62 101.92,27.46 106.52,27.46 v106.84,27.78 | v166.37,15.88 166.37,17.46 167,17.46 167.48,17.94 168.12,17.94 169.54,19.37 169.54,27.78 151.45,27.78 150.97,27.3 117.47,27.3 117.16,27.62 114.78,27.62 114.3,27.15 v109.54,27.15
BUS_XFER_BUS_15  (via drill 0.35)
  Top 0.305: IC6.18 106.36,13.02 v106.36,18.57 | v107.95,20 107.79,20.16 v107.79,25.88 | v78.58,26.04 76.36,28.26 76.36,36.2 v76.68,36.51 | v62.39,35.72 62.23,35.56 V5.9 | SV_CREG_2.4 166.53,10.32 168.75,10.32 v168.75,24.92 | v156.69,25.24 154.62,25.24 v154.62,25.4
  Bottom 0.305: v106.36,18.57 107.79,20 v107.95,20 | v78.58,26.04 78.74,25.88 86.04,25.88 86.36,26.19 88.9,26.19 89.06,26.04 107.63,26.04 v107.79,25.88 117,25.88 117.95,26.83 153.19,26.83 v154.62,25.4 | v76.68,36.51 76.04,37.15 69.22,37.15 68.58,36.51 62.87,36.51 62.39,36.04 v62.39,35.72 | v168.75,24.92 168.43,25.24 v156.69,25.24
GND  (via drill 0.35)
  Top 0.305: v97.16,6.67 97.63,7.14 97.63,7.78 C14.2 | IC4.10 107.95,38.42 106.84,37.31 106.84,30.8 | 147.32,30.8 IC3.10 | 126.84,30.8 126.84,9.37 128.11,8.1 C15.2 | 120.49,7.94 120.49,23.02 120.17,23.34 120.17,30.32 R6.1 | 68.58,36.99 68.58,33.18 V5.8 | 68.58,36.99 IC1.10 | IC2.10 39.69,41.59 39.69,33.34 V7.8 | 68.58,36.99 60.33,36.99 v60.33,33.34 | v18.57,7.46 21.11,10 21.11,11.27 C5.2 | v72.23,8.26 72.23,8.1 73.5,8.1 C16.2 | v70.17,8.26 67.15,11.27 C8.2
  Top 0.508: C15.2 153.35,7.94 154.94,6.35 IC5.10 | C14.2 120.49,7.94 122.87,7.94 124.46,6.35 IC6.10 | C16.2 91.12,7.94 92.71,6.35 IC7.7 | C8.2 66.99,31.43 68.58,33.02 V5.8 | C7.2 51.75,31.43 53.34,33.02 V6.8 | C6.2 36.51,31.43 38.1,33.02 V7.8 | C5.2 21.27,31.43 22.86,33.02 V8.8 | C9.2 39.69,46.04 38.1,44.45 IC2.10 | C10.2 70.17,46.04 68.58,44.45 IC1.10 | C11.2 109.54,46.04 107.95,44.45 IC4.10 | C12.2 148.91,46.04 147.32,44.45 IC3.10 | C1.2 9.84,51.75 SV_CREG_1.35 | C2.2 5.08,5.4 SV_CREG_1.2 | C4.2 161.61,2.86 SV_CREG_2.2
  Top 1.016: R16.1 R15.1 R14.1 R13.1 R12.1 106.84,30.8 R11.1 R10.1 R9.1 R8.1 R7.1 R6.1 R5.1 R4.1 126.84,30.8 R3.1 R2.1 R1.1 147.32,30.8 160.23,30.8 161,31.57 161,32.99 R18.1 R17.1 160.97,49.1 164.78,52.91 C3.2 167.64,50.48 SV_CREG_2.35
  Bottom 0.305: IC7.7 94.3,6.67 v97.16,6.67 | SV_CREG_2.2 164.78,6.67 156.53,6.67 IC5.10 | SV_CREG_1.35 6.19,48.1 4.6,48.1 1.75,45.24 1.75,6.35 SV_CREG_1.2 6.35,7.62 18.41,7.62 v18.57,7.46 | 40.4,31.99 40.48,31.91 53.18,31.91 54.29,33.02 V6.8 60.01,33.02 v60.33,33.34 | 40.4,31.99 V7.8 | V8.8 24.77,32.38 30.32,32.38 30.8,31.91 40.32,31.91 40.4,31.99 | v70.17,8.26 v72.23,8.26
  pour Top (isolate 0.406): -2.54,50.8 5.08,58.42 167.64,58.42 175.26,50.8 175.26,5.08 167.64,-2.54 5.08,-2.54 -2.54,5.08
N$1  (via drill 0.35)
  Top 0.305: v133.99,37.94 133.99,37.15 133.35,36.51 LED_1.A 133.35,36.35 134.46,35.24 134.46,33.18 v135.73,31.91 | v13.18,13.81 v13.18,46.2 | v88.9,5.87 89.06,5.71 89.06,3.17 90.96,1.27 138.27,1.27 | 138.27,1.27 152.4,1.27 IC5.9 | v135.73,8.73 v135.73,28.89 | v137.48,6.99 138.27,6.19 138.27,1.27
  Bottom 0.305: v133.99,37.94 134.78,38.73 140.34,38.73 IC3.9 | v13.18,46.2 IC2.19 | v13.18,13.81 15.4,11.59 24.92,11.59 26.19,10.32 54.61,10.32 54.93,10.64 62.71,10.64 64.29,9.05 79.06,9.05 79.53,9.53 85.25,9.53 v88.9,5.87 | v135.73,28.89 v135.73,31.91 | v137.48,6.99 v135.73,8.73
N$2  (via drill 0.35)
  Top 0.305: LED_2.A 130.81,36.51 131.29,36.99 v131.29,40.8 130.97,41.12 130.97,44.61 v128.43,47.15 | IC2.16 27.15,49.05 v37.47,49.05 | v80.17,44.61 80.33,44.77 v80.33,48.9 | v146.21,29.69 v146.21,8.73 | v143.35,32.54 142.24,33.66 IC3.8
  Bottom 0.305: v131.29,40.8 131.44,40.96 140.34,40.96 142.24,42.86 IC3.8 | v37.47,49.05 38.73,49.05 39.21,49.53 40.48,49.53 43.81,46.2 50.64,46.2 51.44,45.4 74.45,45.4 75.25,44.61 v80.17,44.61 | v80.33,48.9 80.49,49.05 87.95,49.05 89.06,50.16 89.06,52.55 111.12,52.55 111.92,51.75 123.35,51.75 124.14,52.55 127.32,52.55 128.43,51.44 v128.43,47.15 | v146.21,8.73 IC5.8 | v143.35,32.54 v146.21,29.69
N$3  (via drill 0.35)
  Top 0.305: v128.75,39.69 128.75,36.99 128.27,36.51 LED_3.A 128.27,36.2 v126.84,34.77 | IC3.7 139.7,40.48 v139.38,40.16 139.54,40.16 139.54,33.66 v139.86,33.34 | v32.23,46.51 34.45,44.29 v34.45,39.21 | v83.98,35.88 v83.98,38.26 | IC5.7 149.07,6.83 153.67,6.83 153.67,4.29 154.62,3.33 157.96,3.33 v157.96,14.92 | v148.59,29.69 v148.59,17.62
  Bottom 0.305: v128.75,39.69 129.06,40.01 136.53,40.01 136.84,40.32 139.22,40.32 v139.38,40.16 | v32.23,46.51 IC2.15 | v34.45,39.21 35.72,37.94 37.94,37.94 38.58,38.58 47.94,38.58 48.58,37.94 67.63,37.94 68.26,38.58 83.66,38.58 v83.98,38.26 | v83.98,35.88 85.09,34.77 103.35,34.77 103.66,35.08 121.13,35.08 121.44,34.77 v126.84,34.77 | v157.96,14.92 154.94,17.94 148.91,17.94 v148.59,17.62 | v148.59,29.69 148.59,31.91 148.91,32.23 148.91,33.34 v139.86,33.34
N$4  (via drill 0.35)
  Top 0.305: v126.21,38.89 126.21,36.99 125.73,36.51 LED_4.A 125.73,36.35 v124.94,35.56 | IC3.6 v137.16,39.53 137.16,34.77 v138.59,33.34 | v35.56,46.51 36.99,45.09 v36.99,38.73 | v84.93,36.04 v84.93,38.42 | v144.78,8.73 143.35,10.16 143.35,28.57 v142.24,29.69
  Bottom 0.305: v126.21,38.89 131.13,38.89 131.76,39.53 v137.16,39.53 | v35.56,46.51 IC2.12 | v36.99,38.73 37.31,39.05 48.26,39.05 48.9,38.42 67.31,38.42 67.94,39.05 84.3,39.05 v84.93,38.42 | v84.93,36.04 85.72,35.24 103.03,35.24 103.35,35.56 121.44,35.56 121.76,35.24 124.62,35.24 v124.94,35.56 | v144.78,8.73 IC5.6 | v138.59,33.34 v142.24,29.69
N$5  (via drill 0.35)
  Top 0.305: v124.78,38.1 123.19,36.51 LED_5.A 123.19,36.04 v122.08,36.04 | 133.59,39.45 134.62,40.48 IC3.5 | 133.59,39.45 v132.87,38.73 | IC2.9 36.04,42.7 v36.04,39.21 | v85.88,36.2 v85.88,38.58 | v142.08,8.73 140.81,10 v140.81,29.69 | v137.64,32.07 134.94,34.77 134.94,38.1 133.59,39.45
  Bottom 0.305: v124.78,38.1 126.52,38.1 126.84,38.42 131.44,38.42 131.76,38.73 v132.87,38.73 | v36.04,39.21 36.35,39.53 48.58,39.53 49.21,38.89 66.99,38.89 67.63,39.53 84.93,39.53 v85.88,38.58 | v85.88,36.2 86.36,35.72 102.71,35.72 103.03,36.04 v122.08,36.04 | IC5.5 142.24,8.73 v142.08,8.73 | v140.81,29.69 138.43,32.07 v137.64,32.07
N$6  (via drill 0.35)
  Top 0.305: v121.44,37.31 120.65,36.51 LED_6.A | IC3.4 v132.08,37.94 | IC2.6 29.69,41.43 v29.69,39.69 | v86.04,39.53 86.84,38.73 v86.84,36.51 | v139.7,8.73 138.27,10.16 138.27,23.81 137.64,24.45 137.64,28.26 137.95,28.57 v137.95,29.69
  Bottom 0.305: 126.21,37.31 126.52,37.31 127.16,37.94 v132.08,37.94 | 126.21,37.31 v121.44,37.31 120.65,36.51 v86.84,36.51 | v29.69,39.69 30,40.01 48.9,40.01 49.53,39.37 66.67,39.37 67.31,40.01 85.57,40.01 v86.04,39.53 | v139.7,8.73 IC5.4 | v137.95,29.69 137.95,31.27 137.32,31.27 136.84,31.75 136.84,34.13 140.18,34.13 140.49,33.81 142.88,33.81 144.15,35.08 144.15,36.2 139.54,36.2 138.91,35.56 127.95,35.56 126.21,37.31
N$7  (via drill 0.35)
  Top 0.305: v118.75,41.27 118.75,37.15 118.11,36.51 LED_7.A | IC2.5 26.35,42.23 26.35,41.43 v29.69,38.1 | v133.51,29.53 v133.51,8.73 | v130.02,33.97 129.54,34.45 IC3.3
  Bottom 0.305: IC3.3 127.79,41.43 118.9,41.43 v118.75,41.27 117.63,41.27 114.46,38.1 100.65,38.1 99.54,36.99 87.47,36.99 87.15,37.31 86.52,37.31 86.2,36.99 83.34,36.99 82.71,37.62 68.9,37.62 68.26,36.99 50.96,36.99 49.85,35.88 33.02,35.88 31.59,37.31 30.48,37.31 v29.69,38.1 | v133.51,8.73 IC5.3 | v133.51,29.53 133.51,33.97 v130.02,33.97
N$8  (via drill 0.35)
  Top 0.305: v115.57,40.32 LED_8.A | IC5.2 131.29,1.75 112.87,1.75 112.87,6.03 112.08,6.83 105.25,6.83 105.25,4.13 104.46,3.33 96.36,3.33 96.36,10.48 97.47,11.59 97.47,18.26 97.16,18.57 97.16,20.8 97.63,21.27 v97.63,21.59 | v91.6,22.38 91.92,22.7 91.92,38.42 v91.6,38.73
  Bottom 0.305: 116.6,41.35 118.59,43.34 122.56,43.34 124.14,44.93 125.25,44.93 IC3.2 | 116.6,41.35 v115.57,40.32 | v97.63,21.59 96.84,22.38 v91.6,22.38 | v91.6,38.73 95.41,38.73 98.03,41.35 | 98.03,41.35 98.11,41.43 116.52,41.43 116.6,41.35 | IC2.2 19.53,41.43 97.95,41.43 98.03,41.35
N$9  (via drill 0.35)
  Top 0.305: v110.65,38.89 113.03,36.51 LED_9.A 113.03,36.35 113.82,35.56 113.82,34.45 v114.46,33.81 | v107.16,39.85 105.41,41.59 IC4.9 | IC1.19 50.01,52.55 54.77,52.55 54.77,49.85 56.04,48.58 71.28,48.58 v71.28,49.53 | v76.68,49.53 77.15,49.05 v77.15,47.31 | v97.95,45.09 99.22,43.81 v99.22,39.85 | IC6.9 123.67,3.33 125.57,3.33 125.57,15.88 124.94,16.51 124.94,24.13 v120.97,28.1
  Bottom 0.305: v110.65,38.89 110.33,38.58 108.43,38.58 108.03,38.97 | v107.16,39.85 108.03,38.97 | v76.68,49.53 v71.28,49.53 | v77.15,47.31 79.06,45.4 97.63,45.4 v97.95,45.09 | v99.22,39.85 100.17,38.89 107.95,38.89 108.03,38.97 | v120.97,28.1 120.49,28.57 119.06,28.57 114.46,33.18 v114.46,33.81
N$10  (via drill 0.35)
  Top 0.305: v108.74,39.37 108.74,38.26 110.49,36.51 LED_10.A 110.49,36.35 111.28,35.56 111.28,34.45 v111.92,33.81 | 103.58,42.31 102.87,43.02 IC4.8 | 103.58,42.31 v105.25,40.64 | IC1.16 55.88,53.66 56.67,54.45 101.76,54.45 v101.76,49.05 | v103.98,47.15 103.66,46.83 103.66,42.39 103.58,42.31 | v115.73,29.53 v115.73,8.73
  Bottom 0.305: v108.74,39.37 107.47,40.64 v105.25,40.64 | v101.76,49.05 102.87,47.94 103.19,47.94 v103.98,47.15 | v115.73,8.73 IC6.8 | v115.73,29.53 111.92,33.34 v111.92,33.81
N$11  (via drill 0.35)
  Top 0.305: v107.95,37.31 LED_11.A 107.95,36.35 108.74,35.56 108.74,34.45 v109.38,33.81 | v100.97,37.31 100.33,37.94 IC4.7 | v113.19,29.53 v113.19,8.73 | IC1.15 60.17,52.55 77.95,52.55 v77.95,36.83 | v83.5,34.92 87.47,30.96 v87.47,29.53
  Bottom 0.305: v100.97,37.31 v107.95,37.31 | v113.19,8.73 IC6.7 | 111.52,31.19 109.38,33.34 v109.38,33.81 | 111.52,31.19 v113.19,29.53 | v77.95,36.83 79.85,34.92 v83.5,34.92 | v87.47,29.53 88.9,28.1 106.05,28.1 106.68,28.73 109.06,28.73 111.52,31.19
N$12  (via drill 0.35)
  Top 0.305: v102.23,39.69 104.7,37.23 | 104.7,37.23 105.41,36.51 LED_12.A | v98.42,40.64 97.79,41.27 IC4.6 | v83.03,51.59 83.98,50.64 v83.98,47.31 | v110.65,8.73 110.33,9.05 110.33,27.78 v108.58,29.53 | v104.3,33.81 104.62,34.13 104.62,37.15 104.7,37.23
  Bottom 0.305: v102.23,39.69 101.28,40.64 v98.42,40.64 | IC1.12 67.79,49.05 68.9,49.05 73.03,53.18 81.44,53.18 v83.03,51.59 | v83.98,47.31 85.41,45.88 98.27,45.88 98.74,45.4 98.74,43.18 IC4.6 | v110.65,8.73 IC6.6 | v104.3,33.81 v108.58,29.53
N$13  (via drill 0.35)
  Top 0.305: LED_13.A 102.87,36.51 101.44,37.94 101.44,44.13 99.69,45.88 95.25,45.88 IC4.5 95.25,41.43 v94.46,40.64 | v66.04,40.64 IC1.9 | IC6.5 109.06,2.38 95.09,2.38 95.09,26.51 93.34,28.26 v93.34,39.53
  Bottom 0.305: v66.04,40.64 66.36,40.96 93.34,40.96 | 93.34,40.96 94.14,40.96 v94.46,40.64 | 93.34,40.96 v93.34,39.53
N$14  (via drill 0.35)
  Top 0.305: 96.04,35.56 98.27,35.56 98.58,35.88 98.58,36.35 100.33,36.35 LED_14.A | 96.04,35.56 96.04,37.94 92.71,41.27 IC4.4 92.71,43.5 v89.53,46.67 | v62.39,47.15 IC1.6 | IC6.4 107,2.86 95.57,2.86 95.57,26.83 93.82,28.57 93.82,34.61 94.77,35.56 96.04,35.56
  Bottom 0.305: v62.39,47.15 63.34,48.1 88.11,48.1 v89.53,46.67
N$15  (via drill 0.35)
  Top 0.305: v96.52,43.97 96.52,37.78 97.79,36.51 LED_15.A | IC1.5 57.15,41.91 v57.15,40.64 | 89.14,40.88 90.17,41.91 IC4.3 | 89.14,40.88 v88.42,40.16 | v103.03,8.73 102.71,9.05 102.71,14.13 v97.95,18.89 | v89.22,19.68 89.22,40.8 89.14,40.88
  Bottom 0.305: v96.52,43.97 95.57,44.93 91.92,44.93 IC4.3 | v57.15,40.64 57.47,40.96 64.61,40.96 65.72,39.85 66.36,39.85 66.99,40.48 88.11,40.48 v88.42,40.16 | v103.03,8.73 IC6.3 | v97.95,18.89 97.16,19.68 v89.22,19.68
N$16  (via drill 0.35)
  Top 0.305: v94.14,37.78 94.14,37.62 95.25,36.51 LED_16.A | v87.63,37.94 IC4.2 87.63,44.93 90.49,44.93 91.28,44.13 91.28,41.91 92.39,40.8 92.39,18.41 91.6,17.62 91.6,10.48 v93.34,8.73 | IC6.2 102.39,6.83 v98.9,6.83
  Bottom 0.305: v94.14,37.78 93.98,37.94 v87.63,37.94 | v98.9,6.83 97,8.73 v93.34,8.73 | IC1.2 50.01,44.93 74.14,44.93 75.25,43.81 83.66,43.81 84.77,44.93 85.88,44.93 IC4.2
N$17
  Top 0.305: R21.1 LOAD.2
N$18
  Top 0.305: R20.1 ASSERT_ADDR.2
N$19
  Top 0.508: R1.2 LED_1.C
N$20
  Top 0.305: R19.1 ASSERT_XFER.2
N$21  (via drill 0.35)
  Top 0.305: v16.67,47.15 16.67,34.92 18.73,32.86 v18.73,28.26 | v34.29,28.26 35.88,29.84 35.88,34.77 v38.89,37.78 | v46.04,37.78 47.15,38.89 v47.15,46.99 | v73.82,46.67 73.82,29.21 71.6,26.99 71.6,25.08 70.48,23.97 68.1,23.97 68.1,22.07 V5.3
  Bottom 0.305: v16.67,47.15 IC2.18 | v18.73,28.26 20.16,26.83 32.7,26.83 34.13,28.26 v34.29,28.26 | v46.04,37.78 v38.89,37.78 | v47.15,46.99 56.83,46.99 57.47,46.35 73.5,46.35 v73.82,46.67
N$22  (via drill 0.35)
  Top 0.305: v67.79,19.84 V5.2 | v50.16,23.97 47.62,21.43 43.66,21.43 43.66,16.83 37.47,10.64 37.47,10.48 37.31,10.32 33.66,10.32 v33.66,13.49 | v34.77,14.61 34.45,14.61 32.38,16.67 30.32,16.67 30.32,17.14 29.05,18.41 v29.05,21.11 | v25.88,21.75 22.54,21.75 v22.54,22.07 | v19.53,25.08 19.53,41.91 19.21,42.23 v19.21,47.15
  Bottom 0.305: v67.79,19.84 66.67,20.95 66.04,20.95 63.98,23.02 63.98,23.97 v50.16,23.97 | v34.77,14.61 v33.66,13.49 | v29.05,21.11 28.42,21.75 v25.88,21.75 | v19.53,25.08 v22.54,22.07 | IC2.17 v19.21,47.15
N$23  (via drill 0.35)
  Top 0.305: v26.83,46.51 26.83,42.07 v28.73,40.16 | v49.85,40.16 52.55,37.47 v52.55,36.2 | v61.44,36.2 61.75,36.2 62.07,36.51 64.77,36.51 v64.77,28.26
  Bottom 0.305: IC2.14 28.73,52.55 27.62,52.55 26.83,51.75 v26.83,46.51 | v28.73,40.16 29.05,40.48 49.53,40.48 v49.85,40.16 | v61.44,36.2 v52.55,36.2 | v64.77,28.26 65.09,27.94 V5.6
N$24  (via drill 0.35)
  Top 0.305: V5.7 73.03,30.48 v73.03,31.91 | v116.68,34.29 116.36,34.61 116.36,48.42 v112.24,52.55
  Bottom 0.305: v73.03,31.91 74.3,33.18 102.55,33.18 103.98,34.61 116.36,34.61 v116.68,34.29 | v112.24,52.55 110.65,54.13 41.43,54.13 39.85,52.55 34.77,52.55 IC2.13
N$25  (via drill 0.35)
  Top 0.305: IC2.8 31.27,41.43 31.27,36.2 30.8,35.72 28.1,35.72 27.62,36.2 26.51,36.2 v26.51,24.61 | v40.16,24.13 41.91,22.38 v41.91,22.07 | v52.86,21.75 54.61,21.75 V6.3
  Bottom 0.305: v26.51,24.61 26.99,24.13 v40.16,24.13 | v41.91,22.07 42.23,21.75 v52.86,21.75
N$26  (via drill 0.35)
  Top 0.305: v30.48,36.51 IC2.7 | v50.8,35.72 51.12,35.4 51.12,18.26 v50.96,18.1
  Bottom 0.305: v30.48,36.51 31.59,35.4 50.48,35.4 v50.8,35.72 | v50.96,18.1 51.28,17.78 V6.2
N$27  (via drill 0.35)
  Top 0.305: V6.6 52.55,27.94 v52.55,29.05 | v43.97,29.37 43.66,29.69 43.66,36.35 v43.97,36.67 | v25.24,38.89 22.86,41.27 IC2.4
  Bottom 0.305: v52.55,29.05 52.23,29.37 v43.97,29.37 | v43.97,36.67 43.66,36.99 32.7,36.99 30.8,38.89 v25.24,38.89
N$28  (via drill 0.35)
  Top 0.305: v48.9,30.16 48.1,29.37 45.24,29.37 45.24,40.96 v43.97,42.23 | v40.64,42.55 40.01,43.18 v40.01,45.24 | IC2.3 v22.86,45.72
  Bottom 0.305: V6.7 54.29,30.16 v48.9,30.16 | v43.97,42.23 43.66,42.55 v40.64,42.55 | v40.01,45.24 39.53,45.72 v22.86,45.72
N$29  (via drill 0.35)
  Top 0.305: V7.3 42.7,20.32 42.7,44.29 43.34,44.93 v43.34,49.05
  Bottom 0.305: v43.34,49.05 49.05,49.05 IC1.18
N$30
  Top 0.305: V7.2 43.18,17.78 43.18,43.34 44.93,45.09 44.93,49.53 44.61,49.85 44.61,51.75 45.4,52.55 47.15,52.55 47.15,49.85 47.94,49.05 53.34,49.05 IC1.17
N$31  (via drill 0.35)
  Top 0.305: V7.6 41.43,30 v41.43,43.97 | v44.13,52.86 v44.13,45.4 | v56.67,53.34 57.31,52.7 57.31,49.85 58.1,49.05 60.96,49.05 IC1.14
  Bottom 0.305: v41.43,43.97 42.7,43.97 v44.13,45.4 | v44.13,52.86 44.61,53.34 v56.67,53.34
N$32  (via drill 0.35)
  Top 0.305: v44.45,30.32 44.77,30 44.77,28.1 46.04,26.83 49.69,26.83 49.69,30.48 49.53,30.64 49.53,35.56 50.48,36.51 51.75,36.51 51.75,35.08 52.39,34.45 54.77,34.45 54.77,44.13 v57.78,47.15
  Bottom 0.305: V7.7 39.53,30.32 v44.45,30.32 | v57.78,47.15 58.42,47.78 61.91,47.78 62.71,48.58 62.87,48.58 63.5,49.21 IC1.13
N$33  (via drill 0.35)
  Top 0.305: v29.05,17.14 30,16.19 30,9.53 v31.59,7.94 | v47.31,7.46 48.1,6.67 48.1,4.92 51.44,1.59 58.1,1.59 v58.1,40.16 | IC1.8 v60.48,40.16
  Bottom 0.305: V8.3 27.3,17.14 v29.05,17.14 | v31.59,7.94 39.69,7.94 40.16,7.46 v47.31,7.46 | v60.48,40.16 v58.1,40.16
N$34  (via drill 0.35)
  Top 0.305: v18.41,17.62 17.14,16.35 14.76,16.35 14.76,3.81 15.4,3.17 v15.4,2.22 | v53.5,2.38 54.45,3.33 54.45,4.29 53.5,5.24 52.23,5.24 52.23,6.83 54.45,9.05 54.45,13.02 56.83,15.4 v56.83,19.68 | v58.9,20.64 59.53,21.27 59.53,41.75 IC1.7
  Bottom 0.305: V8.2 23.97,17.62 v18.41,17.62 | v15.4,2.22 53.34,2.22 v53.5,2.38 | v56.83,19.68 57.78,20.64 v58.9,20.64
N$35  (via drill 0.35)
  Top 0.305: v29.84,33.18 v29.84,28.26 | v52.7,35.24 53.34,35.88 IC1.4
  Bottom 0.305: V8.6 24.45,28.26 v29.84,28.26 | v29.84,33.18 31.59,34.92 52.39,34.92 v52.7,35.24
N$36  (via drill 0.35)
  Top 0.305: V8.7 26.04,32.38 v26.04,40.16 | IC1.3 v50.8,40.64
  Bottom 0.305: v26.04,40.16 26.83,40.96 50.48,40.96 v50.8,40.64
N$37
  Bottom 0.305: V5.12 V6.5
N$38
  Bottom 0.305: V5.13 V6.4
N$39
  Bottom 0.305: V6.12 V7.5
N$40
  Bottom 0.305: V6.13 V7.4
N$41
  Bottom 0.305: V7.12 V8.5
N$42
  Bottom 0.305: V7.13 V8.4
N$43  (via drill 0.35)
  Top 0.305: V5.4 71.75,20.95 v71.75,17.3 | v93.19,16.67 94.61,15.24 94.61,4.13 93.34,2.86 90.17,2.86 IC7.6
  Bottom 0.305: v71.75,17.3 72.07,16.99 92.87,16.99 v93.19,16.67
N$44  (via drill 0.35)
  Top 0.305: v73.03,15.72 72.55,16.19 v72.55,26.67
  Bottom 0.305: V8.11 17.62,29.05 30.64,29.05 30.72,28.97 | V7.11 30.72,28.97 | 30.72,28.97 30.8,29.05 40.32,29.05 40.8,28.57 46.35,28.57 V6.11 46.99,28.1 52.7,28.1 53.66,29.05 55.56,29.05 56.67,27.94 V5.11 63.98,27.94 65.09,26.83 72.39,26.83 v72.55,26.67 | IC7.8 89.38,16.03 73.34,16.03 v73.03,15.72
N$45  (via drill 0.35)
  Top 0.305: v73.34,25.08 73.82,24.61 73.82,12.54 71.44,10.16 71.44,7.94 72.55,6.83 82.55,6.83 IC7.3
  Bottom 0.305: V5.5 70.17,25.08 v73.34,25.08
N$50
  Top 0.305: R23.1 DEC.2
N$51
  Top 0.305: R22.1 INC.2
N$54
  Top 0.508: R2.2 LED_2.C
N$55
  Top 0.508: R3.2 LED_3.C
N$56
  Top 0.508: R4.2 LED_4.C
N$57
  Top 0.508: R5.2 LED_5.C
N$58
  Top 0.508: R6.2 LED_6.C
N$59
  Top 0.508: R7.2 LED_7.C
N$66
  Top 0.508: R8.2 LED_8.C
N$67
  Top 0.508: R9.2 LED_9.C
N$68
  Top 0.508: R10.2 LED_10.C
N$69
  Top 0.508: R11.2 LED_11.C
N$70
  Top 0.508: R12.2 LED_12.C
N$71
  Top 0.508: R13.2 LED_13.C
N$72
  Top 0.508: R14.2 LED_14.C
N$73
  Top 0.305: R17.2 CLK.1
N$74
  Top 0.305: R18.2 RESET.1
N$80
  Top 0.508: R15.2 LED_15.C
N$86
  Top 0.508: R16.2 LED_16.C
VCC  (via drill 0.35)
  Top 0.305: v16.83,6.83 19.21,9.21 19.21,11.27 C5.1 | 130.65,10 v131.92,8.73 | 100.17,10 v101.44,8.73 | IC7.14 IC7.13 IC7.12 | v66.67,9.84 65.25,11.27 C8.1 | v72.23,9.84 73.5,9.84 C16.1 | R20.2 R19.2 | R23.2 R21.2 | R23.2 R22.2 | R23.2 | R21.2 R20.2 | R20.2 | R21.2 | R19.2 161.45,18.57 161.45,10.95 164.94,7.46 167.16,7.46 167.16,6.51 SV_CREG_2.1 | R19.2 | R22.2 161.93,30.16 161.93,47.15 162.4,47.62 162.4,49.37 164.94,49.37 SV_CREG_2.36 | R22.2 | IC3.1 125.89,44.61 125.89,47.78 126.05,47.94 | IC4.1 86.52,44.61 86.52,47.78 86.68,47.94 | v75.09,50.64 72.55,48.1 C10.1 | v113.67,49.85 111.92,48.1 C11.1 | v42.55,49.69 42.55,48.58 42.07,48.1 C9.1 | v151.76,49.53 151.29,49.05 151.29,48.1 C12.1 | C2.1 9.68,2.38 8.73,1.43 5.56,1.43 5.56,4.13 3.17,6.51 3.17,50.64 3.65,51.12 5.4,51.12 5.56,50.96
  Top 0.508: C15.1 130.49,9.84 130.65,10 132.08,11.43 IC5.20 | C14.1 100.01,9.84 100.17,10 101.6,11.43 IC6.20 | C16.1 75.88,9.84 77.47,11.43 IC7.14 | C8.1 65.09,13.65 63.5,15.24 V5.16 | C7.1 49.85,13.65 48.26,15.24 V6.16 | C6.1 34.61,13.65 33.02,15.24 V7.16 | C5.1 19.37,13.65 17.78,15.24 V8.16 | C9.1 16.83,47.94 15.24,49.53 IC2.20 | C10.1 47.31,47.94 45.72,49.53 IC1.20 | C11.1 86.68,47.94 85.09,49.53 IC4.20 | C12.1 126.05,47.94 124.46,49.53 IC3.20 | C1.1 5.56,50.96 5.08,50.48 SV_CREG_1.36 | C2.1 9,3.38 9,3.46 7.62,4.83 SV_CREG_1.1 | C4.1 167.32,6.35 SV_CREG_2.1 | C3.1 163.72,54.18 163.72,54.26 163.96,54.5 165.6,54.5 168.81,51.29 168.81,49.05 168.12,48.36 167.16,48.36 165.99,49.53 SV_CREG_2.36
  Bottom 0.305: SV_CREG_1.1 8.1,6.83 v16.83,6.83 | V8.16 17.62,14.13 25.08,14.13 25.56,14.61 31.11,14.61 V7.16 31.91,15.4 35.08,15.4 36.35,14.13 45.88,14.13 V6.16 46.51,14.61 46.67,14.61 48.26,13.02 48.9,13.02 49.69,13.81 60.8,13.81 V5.16 | IC5.1 132.08,8.73 v131.92,8.73 | IC6.1 101.6,8.73 v101.44,8.73 | IC7.12 84.3,10.95 93.03,10.95 94.77,12.7 IC6.20 103.35,10.95 130.33,10.95 IC5.20 | v72.23,9.84 v66.67,9.84 | SV_CREG_1.36 6.35,50.8 IC2.20 | IC4.20 84.93,50.64 v75.09,50.64 | IC3.20 123.51,49.85 v113.67,49.85 | v42.55,49.69 43.66,50.8 IC1.20 | v151.76,49.53 SV_CREG_2.36
  pour Bottom (isolate 0.406): -2.54,50.8 5.08,58.42 167.64,58.42 175.26,50.8 175.26,5.08 167.64,-2.54 5.08,-2.54 -2.54,5.08

## Text on the board
tPlace: + | clk | + | - | LED 1-16 | - | reset | R1-16 | - | + | INC | DEC | load | 16-Bit Counter Register | assert addr | V 1.4 | by Dargonrol | assert xfer | A Xfer | A addr | L Xfer | INC | DEC | jmp 1 | jmp 2 | jmp 3 | jmp 4 | jmp 5